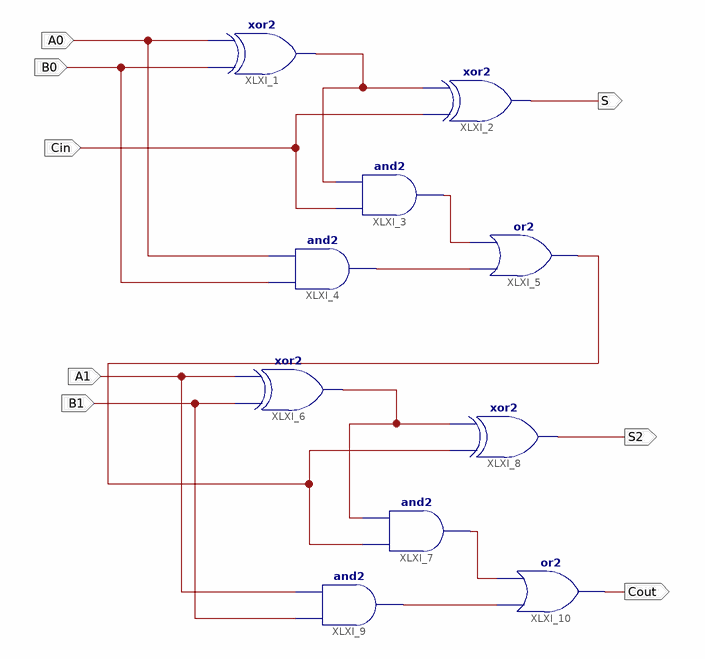
[diagram p0: schematic sheet 1]
// Xilinx ISE schematic fulladder.sch (spartan3e) as structural Verilog: 10 symbols, 8 ports
module fulladder (
  input  Cin,
  input  A0,
  input  B0,
  input  B1,
  input  A1,
  output S,
  output S2,
  output Cout
);

  wire C0, XLXN_1, XLXN_23, XLXN_26, XLXN_47, XLXN_48, XLXN_49;

  xor XLXI_1 (XLXN_1, B0, A0);
  xor XLXI_2 (S, Cin, XLXN_1);
  and XLXI_3 (XLXN_23, Cin, XLXN_1);
  and XLXI_4 (XLXN_26, B0, A0);
  or XLXI_5 (C0, XLXN_26, XLXN_23);
  xor XLXI_6 (XLXN_47, B1, A1);
  and XLXI_7 (XLXN_49, C0, XLXN_47);
  xor XLXI_8 (S2, C0, XLXN_47);
  and XLXI_9 (XLXN_48, B1, A1);
  or XLXI_10 (Cout, XLXN_48, XLXN_49);
endmodule
